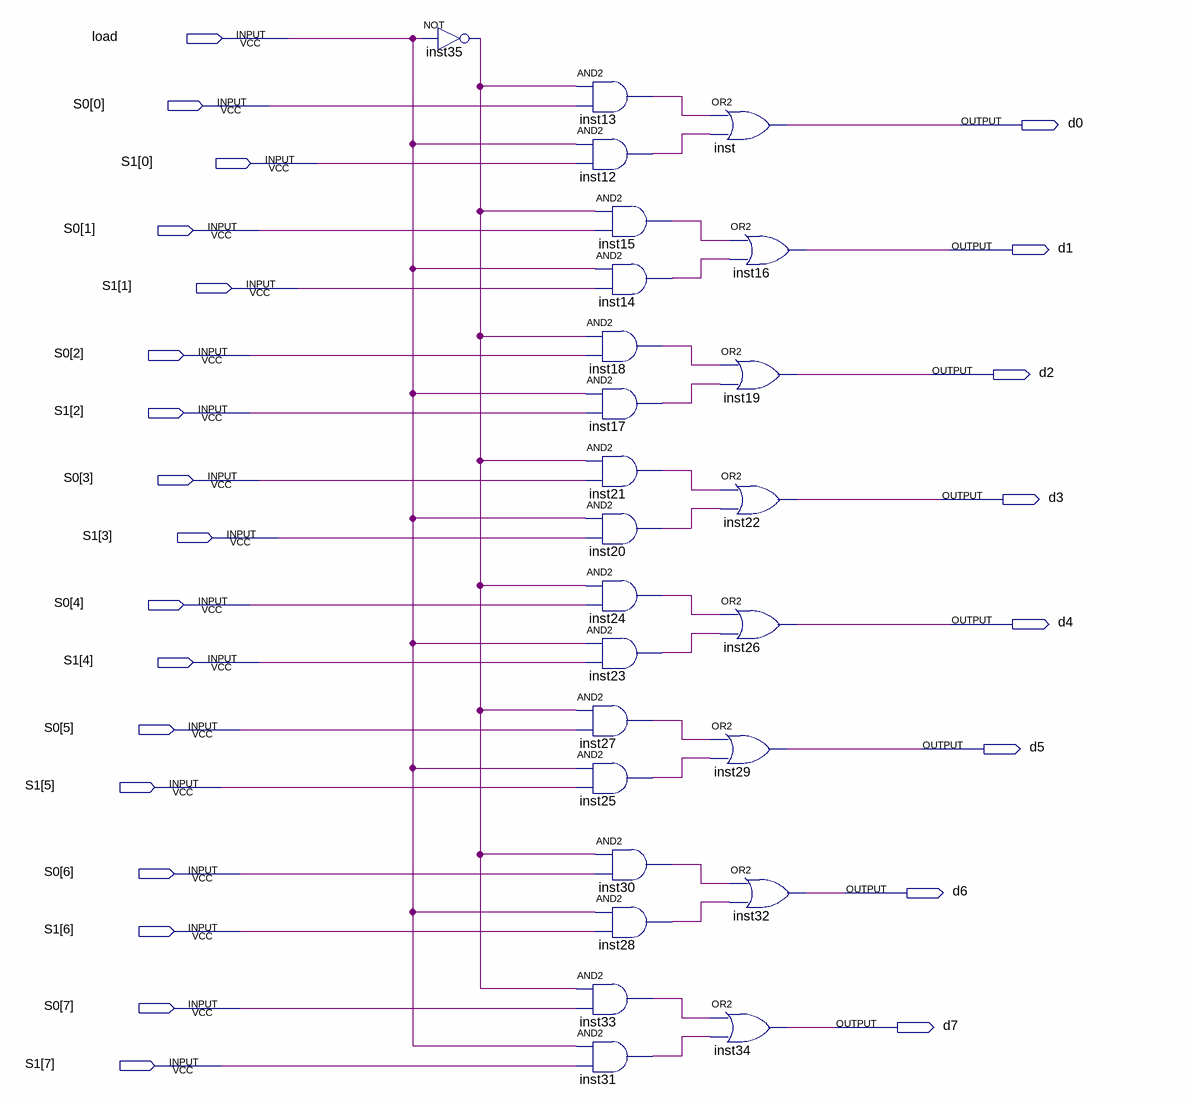
[diagram p0: schematic sheet]
// Quartus schematic mux2.bdf as structural Verilog: 25 symbols, 25 pins
module mux2 (
  input  load,
  input  [7:0] S0,
  input  [7:0] S1,
  output d0,
  output d1,
  output d2,
  output d3,
  output d4,
  output d5,
  output d6,
  output d7
);

  wire inst12_out, inst13_out, inst14_out, inst15_out, inst17_out, inst18_out, inst20_out, inst21_out,
       inst23_out, inst24_out, inst25_out, inst27_out, inst28_out, inst30_out, inst31_out, inst33_out,
       inst35_out;

  not inst35 (inst35_out, load);
  and inst13 (inst13_out, inst35_out, S0[0]);
  and inst12 (inst12_out, load, S1[0]);
  and inst18 (inst18_out, inst35_out, S0[2]);
  and inst17 (inst17_out, load, S1[2]);
  and inst21 (inst21_out, inst35_out, S0[3]);
  and inst20 (inst20_out, load, S1[3]);
  and inst24 (inst24_out, inst35_out, S0[4]);
  and inst23 (inst23_out, load, S1[4]);
  and inst27 (inst27_out, inst35_out, S0[5]);
  and inst25 (inst25_out, load, S1[5]);
  and inst33 (inst33_out, inst35_out, S0[7]);
  and inst31 (inst31_out, load, S1[7]);
  and inst15 (inst15_out, inst35_out, S0[1]);
  and inst14 (inst14_out, load, S1[1]);
  and inst30 (inst30_out, inst35_out, S0[6]);
  and inst28 (inst28_out, load, S1[6]);
  or inst (d0, inst13_out, inst12_out);
  or inst16 (d1, inst15_out, inst14_out);
  or inst19 (d2, inst18_out, inst17_out);
  or inst22 (d3, inst21_out, inst20_out);
  or inst26 (d4, inst24_out, inst23_out);
  or inst29 (d5, inst27_out, inst25_out);
  or inst32 (d6, inst30_out, inst28_out);
  or inst34 (d7, inst33_out, inst31_out);
endmodule
